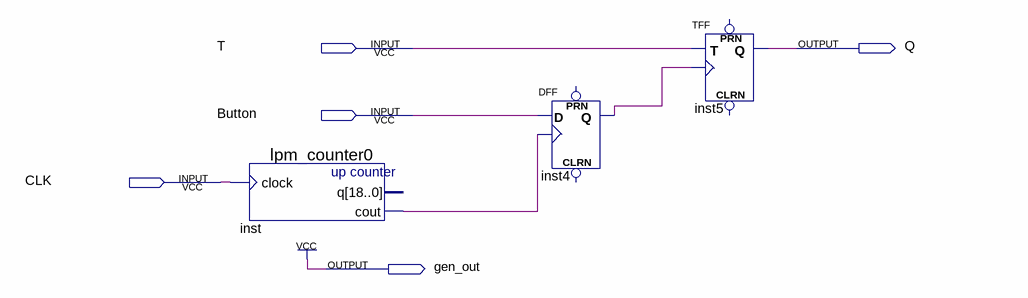
[diagram p0: schematic sheet]
// Quartus schematic lab4-2.bdf as structural Verilog: 3 symbols, 5 pins
module \lab4-2  (
  input  T,
  input  Button,
  input  CLK,
  output Q,
  output gen_out
);

  wire inst4_q, inst_cout;

  lpm_counter0 inst (.clock(CLK), .cout(inst_cout));  // open: q
  DFF inst4 (.CLK(inst_cout), .D(Button), .Q(inst4_q));  // open: CLRN, PRN
  TFF inst5 (.T(T), .CLK(inst4_q), .Q(Q));  // open: PRN, CLRN

  assign gen_out = 1'b1;
endmodule
